# Altium schematic sheet MAX96724_PINOUT.SchDoc
size D; SheetNumber: 10; SheetTotal: 20
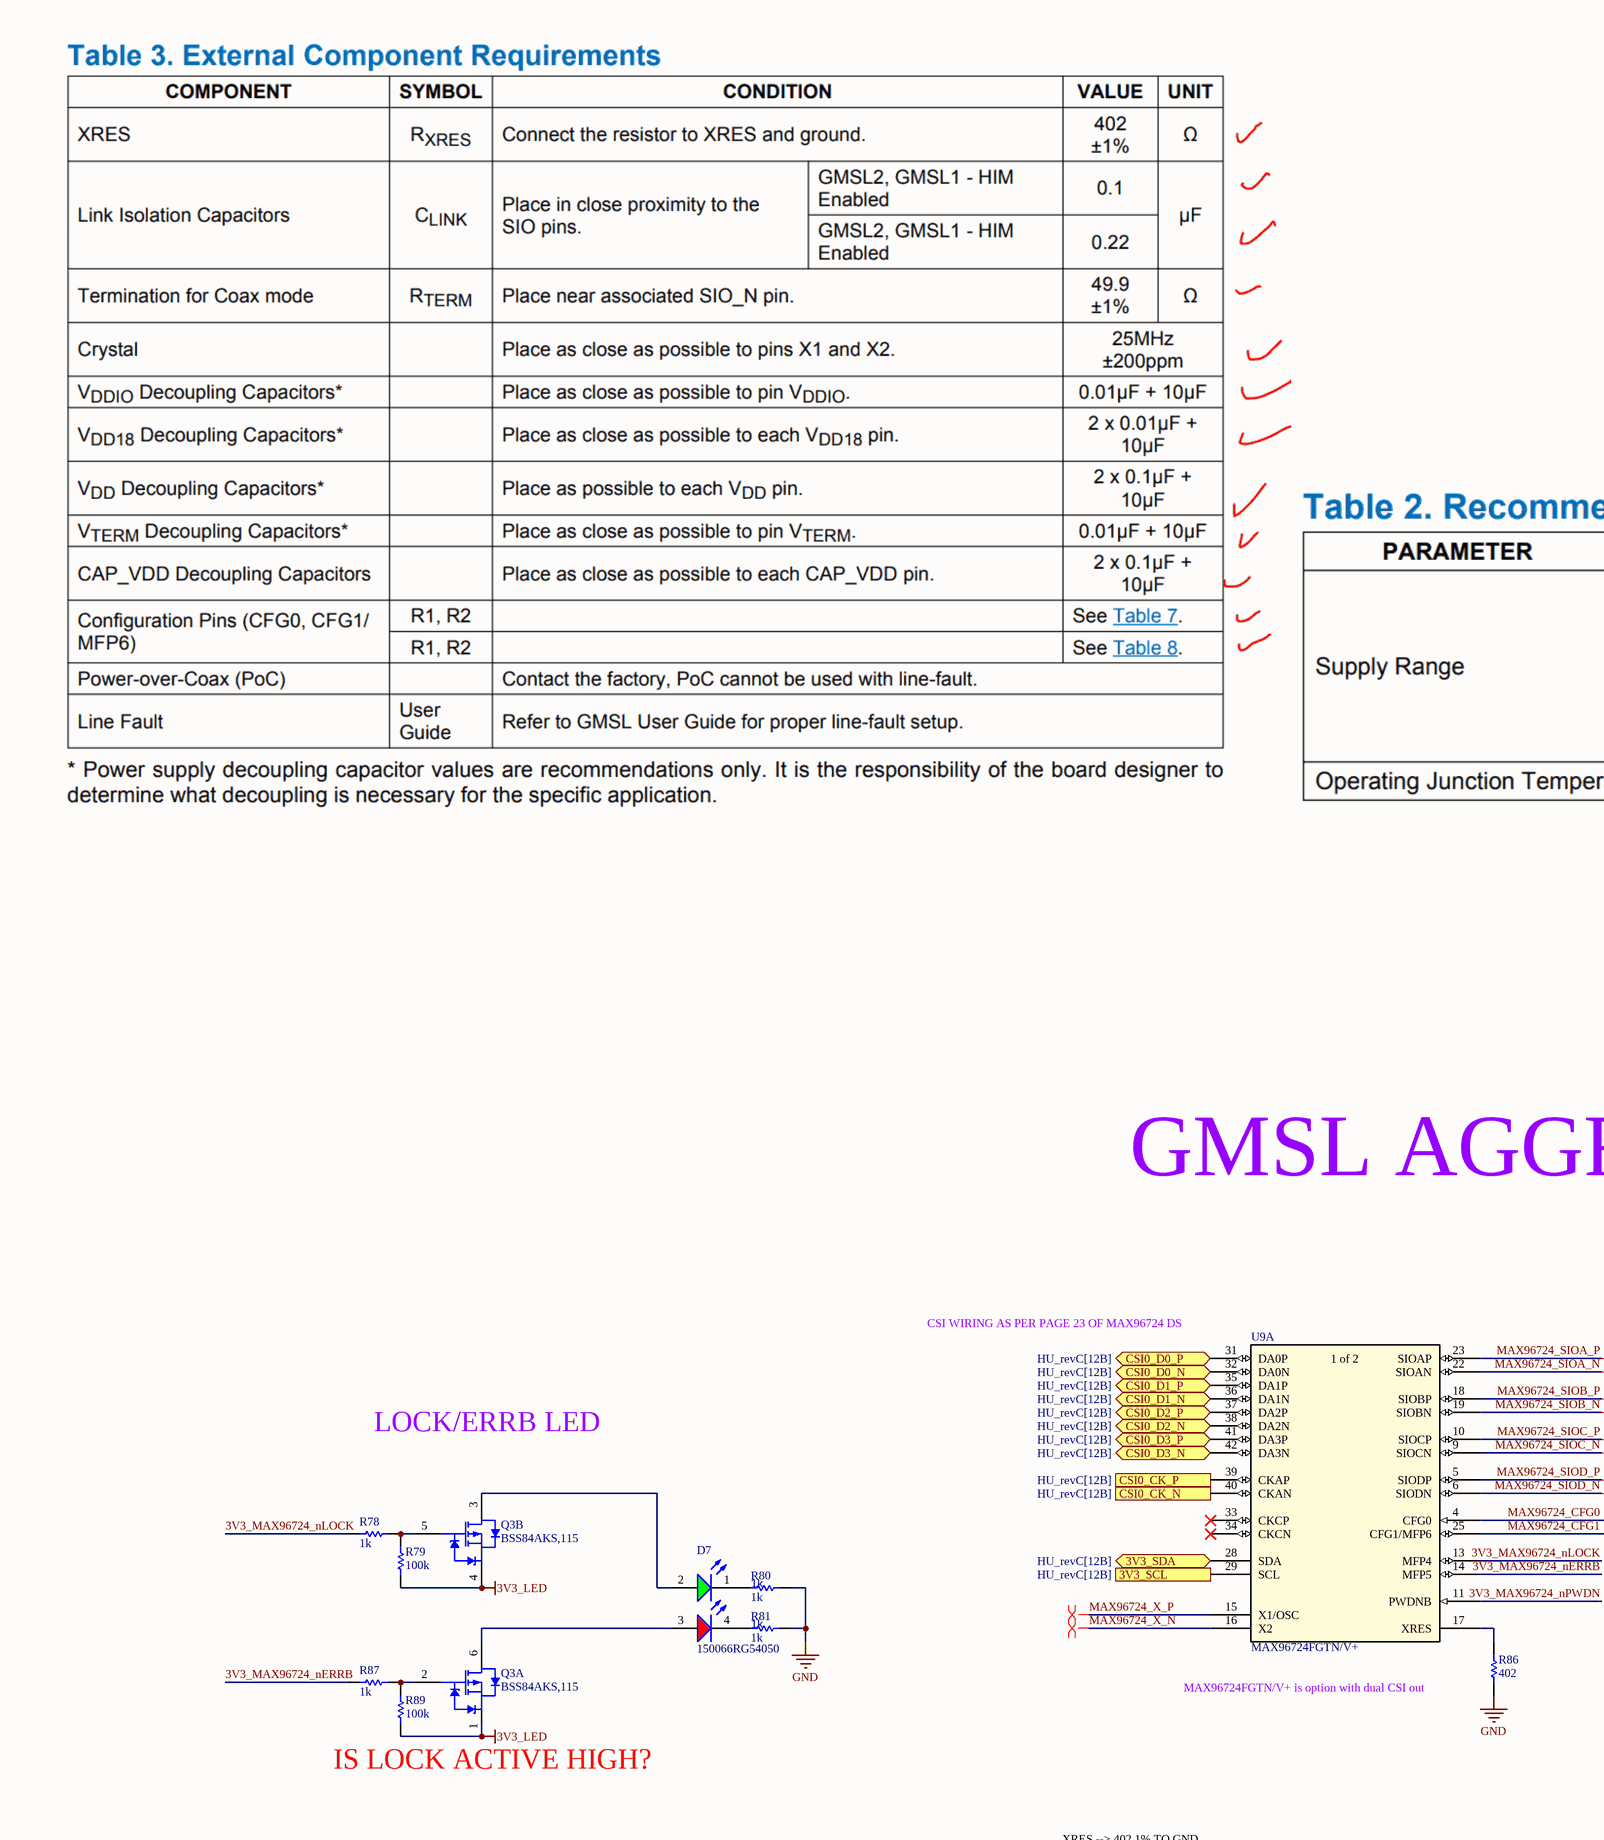
[diagram p0: MAX96724_PINOUT.SchDoc, top left]
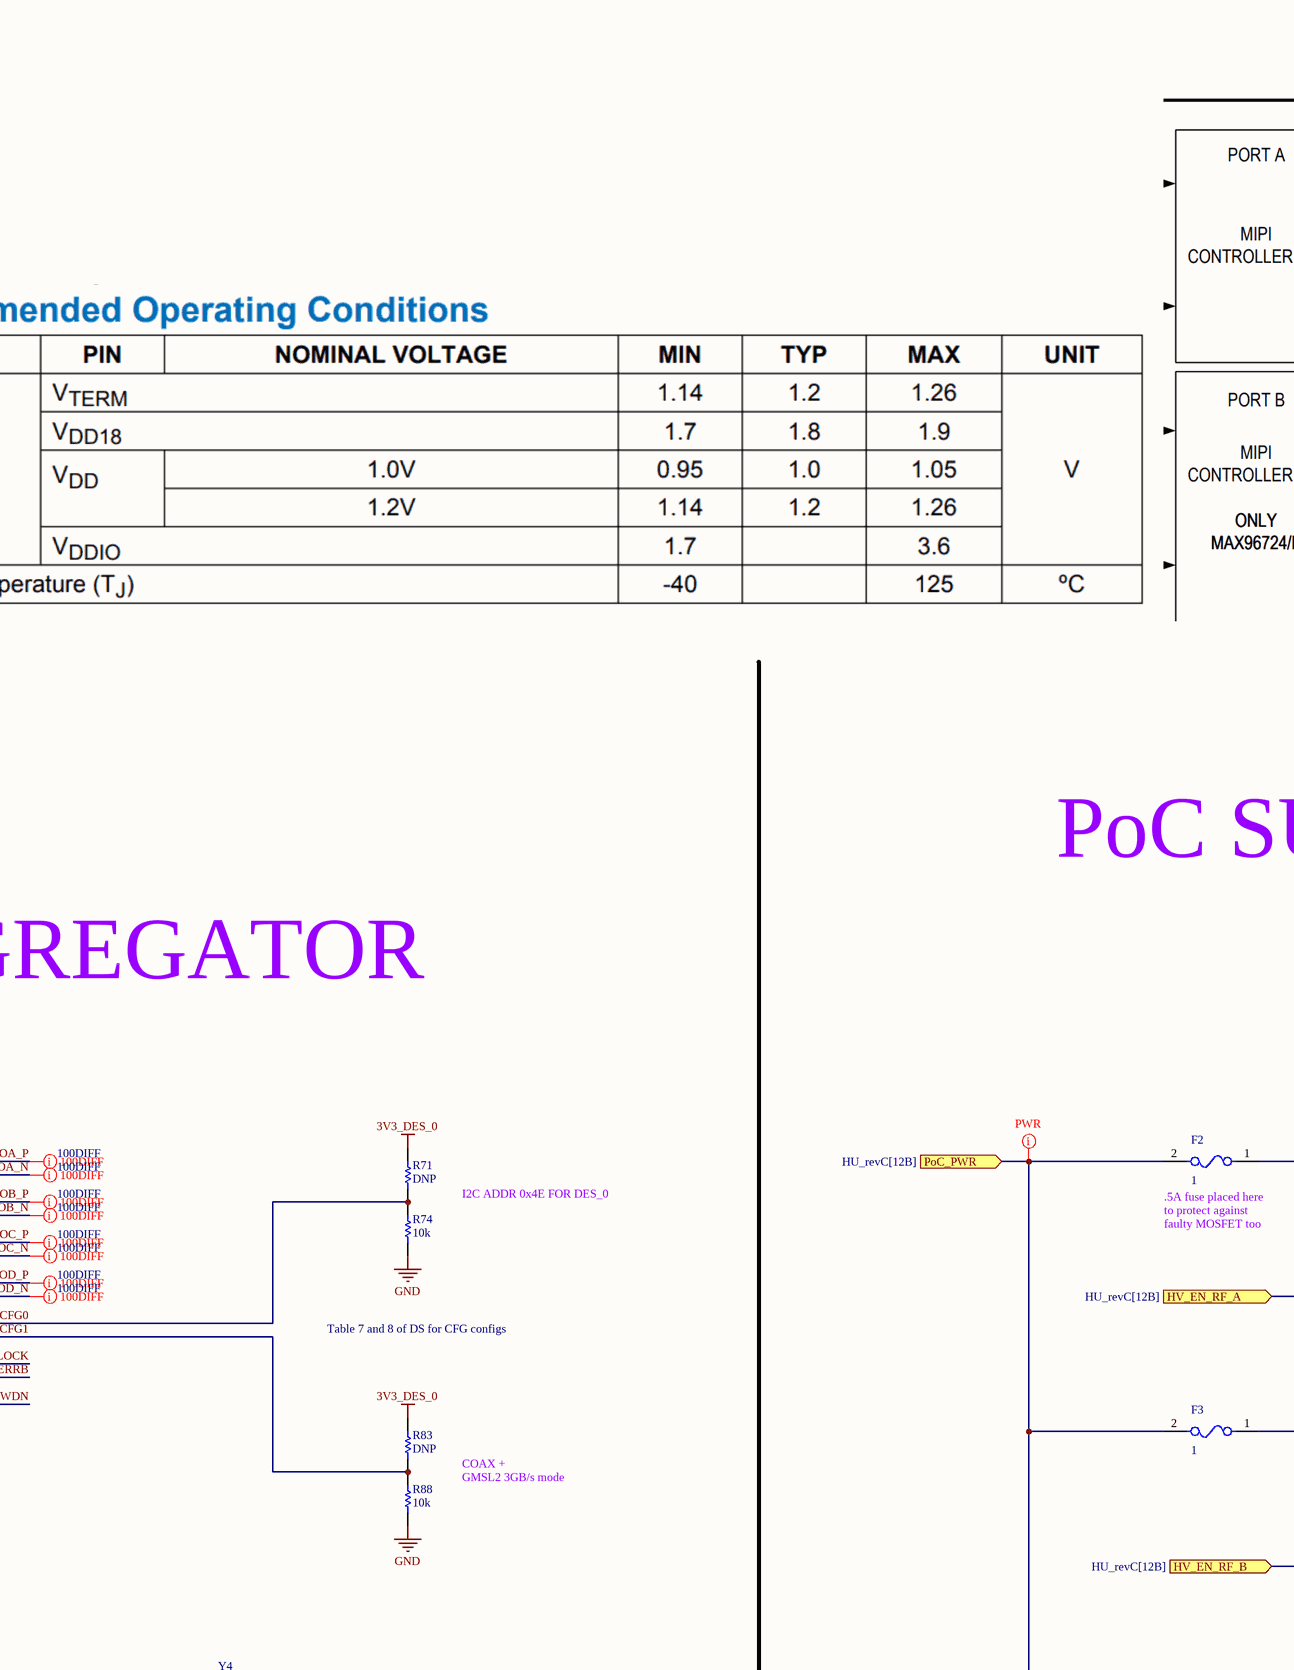
[diagram p1: MAX96724_PINOUT.SchDoc, top middle]
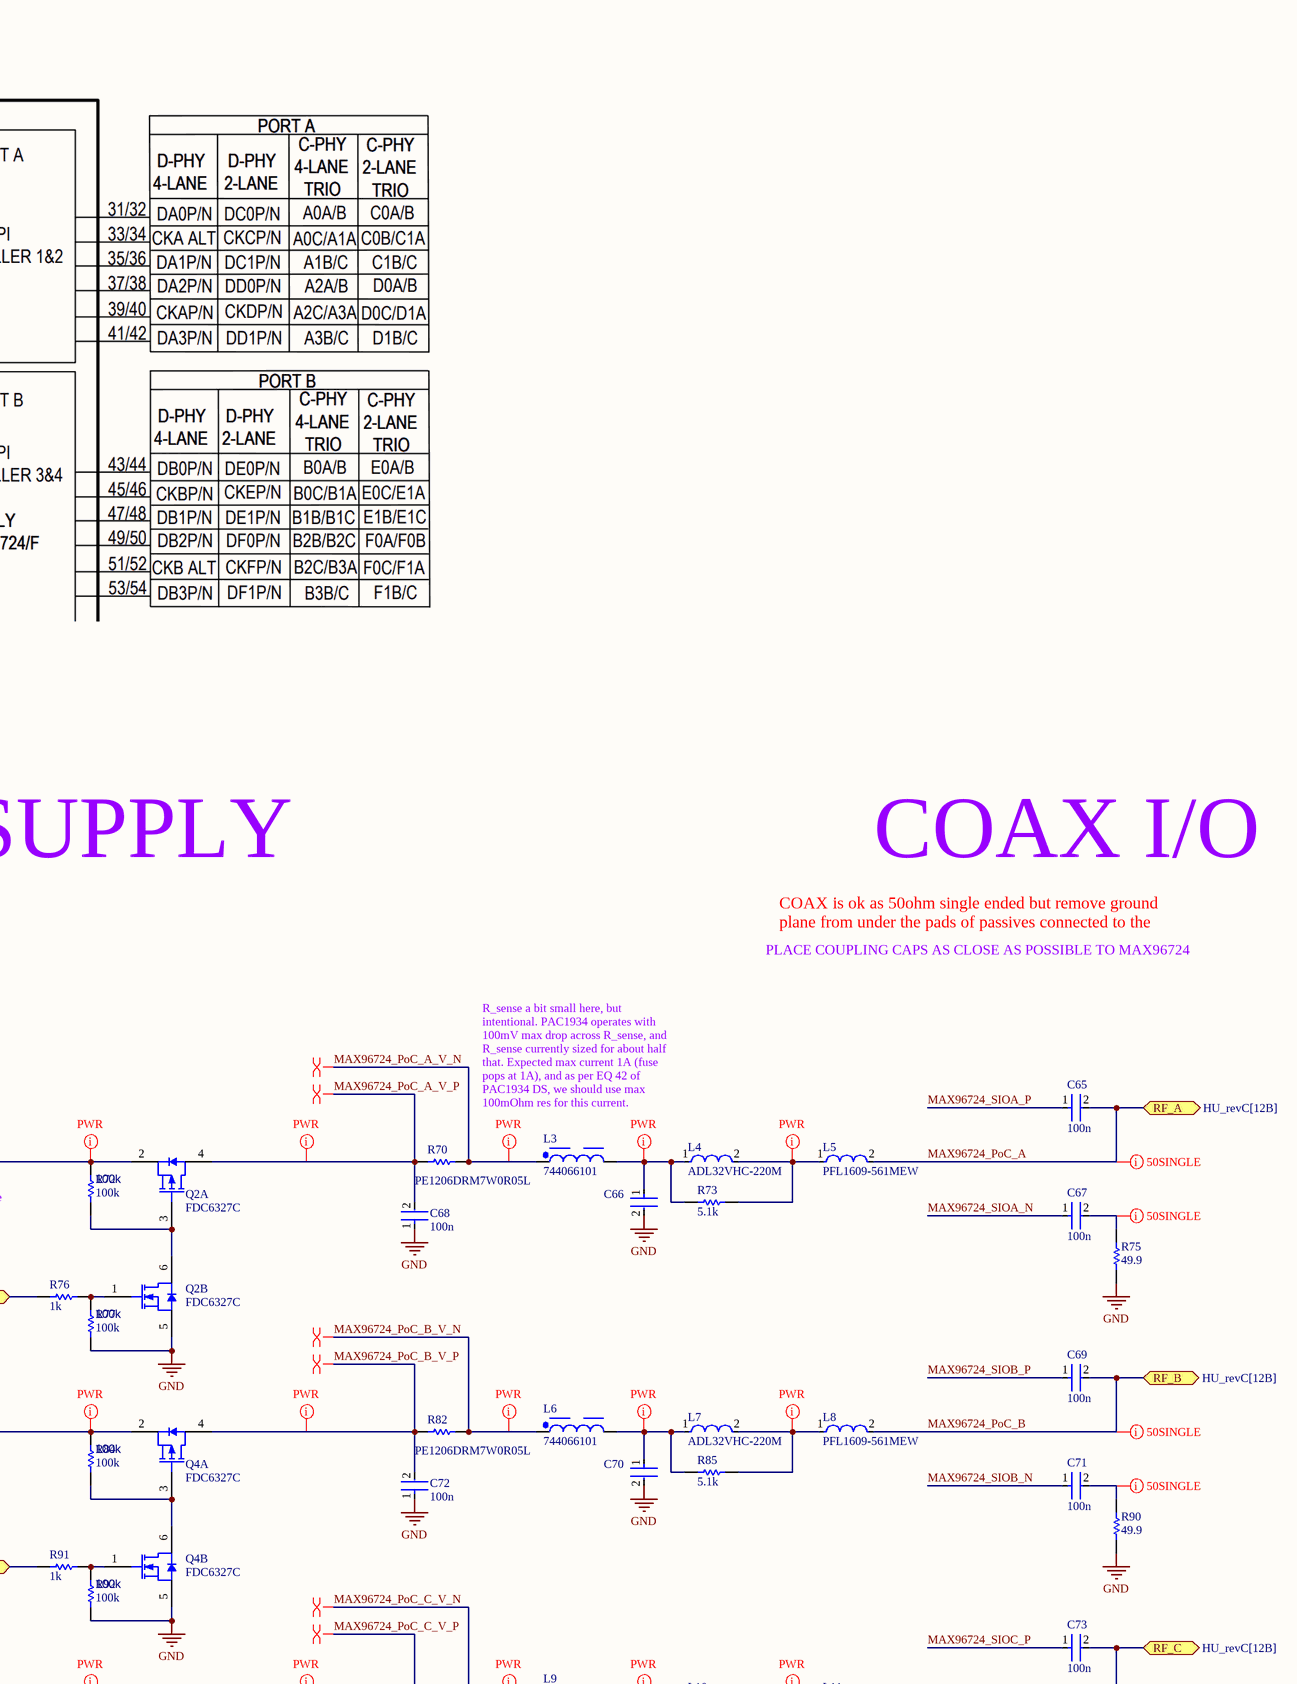
[diagram p2: MAX96724_PINOUT.SchDoc, top right]
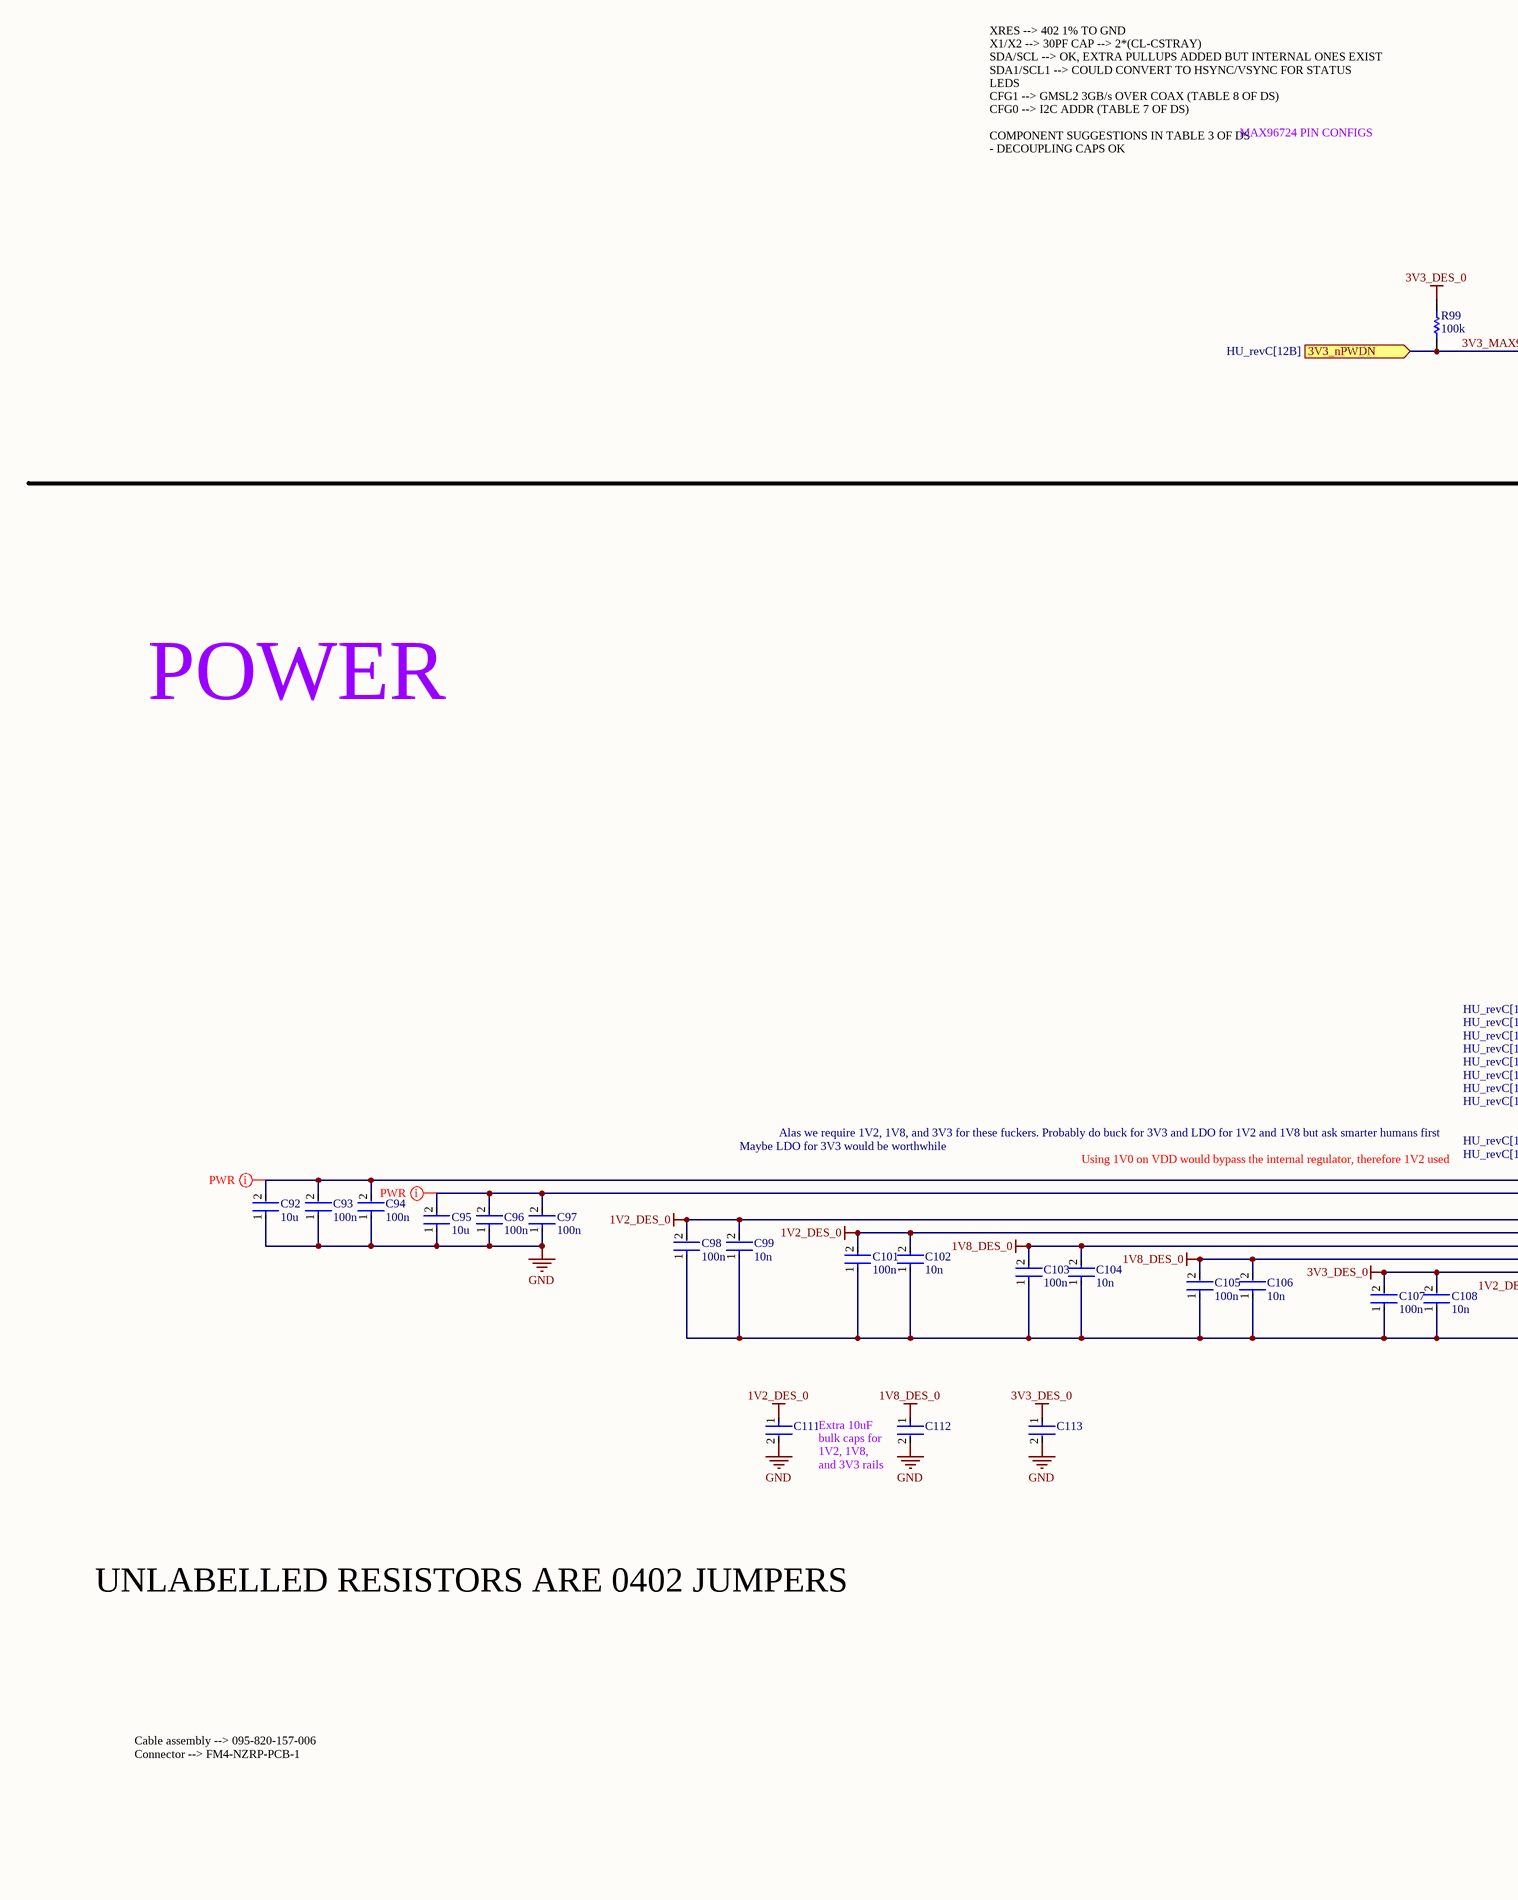
[diagram p3: MAX96724_PINOUT.SchDoc, bottom left]
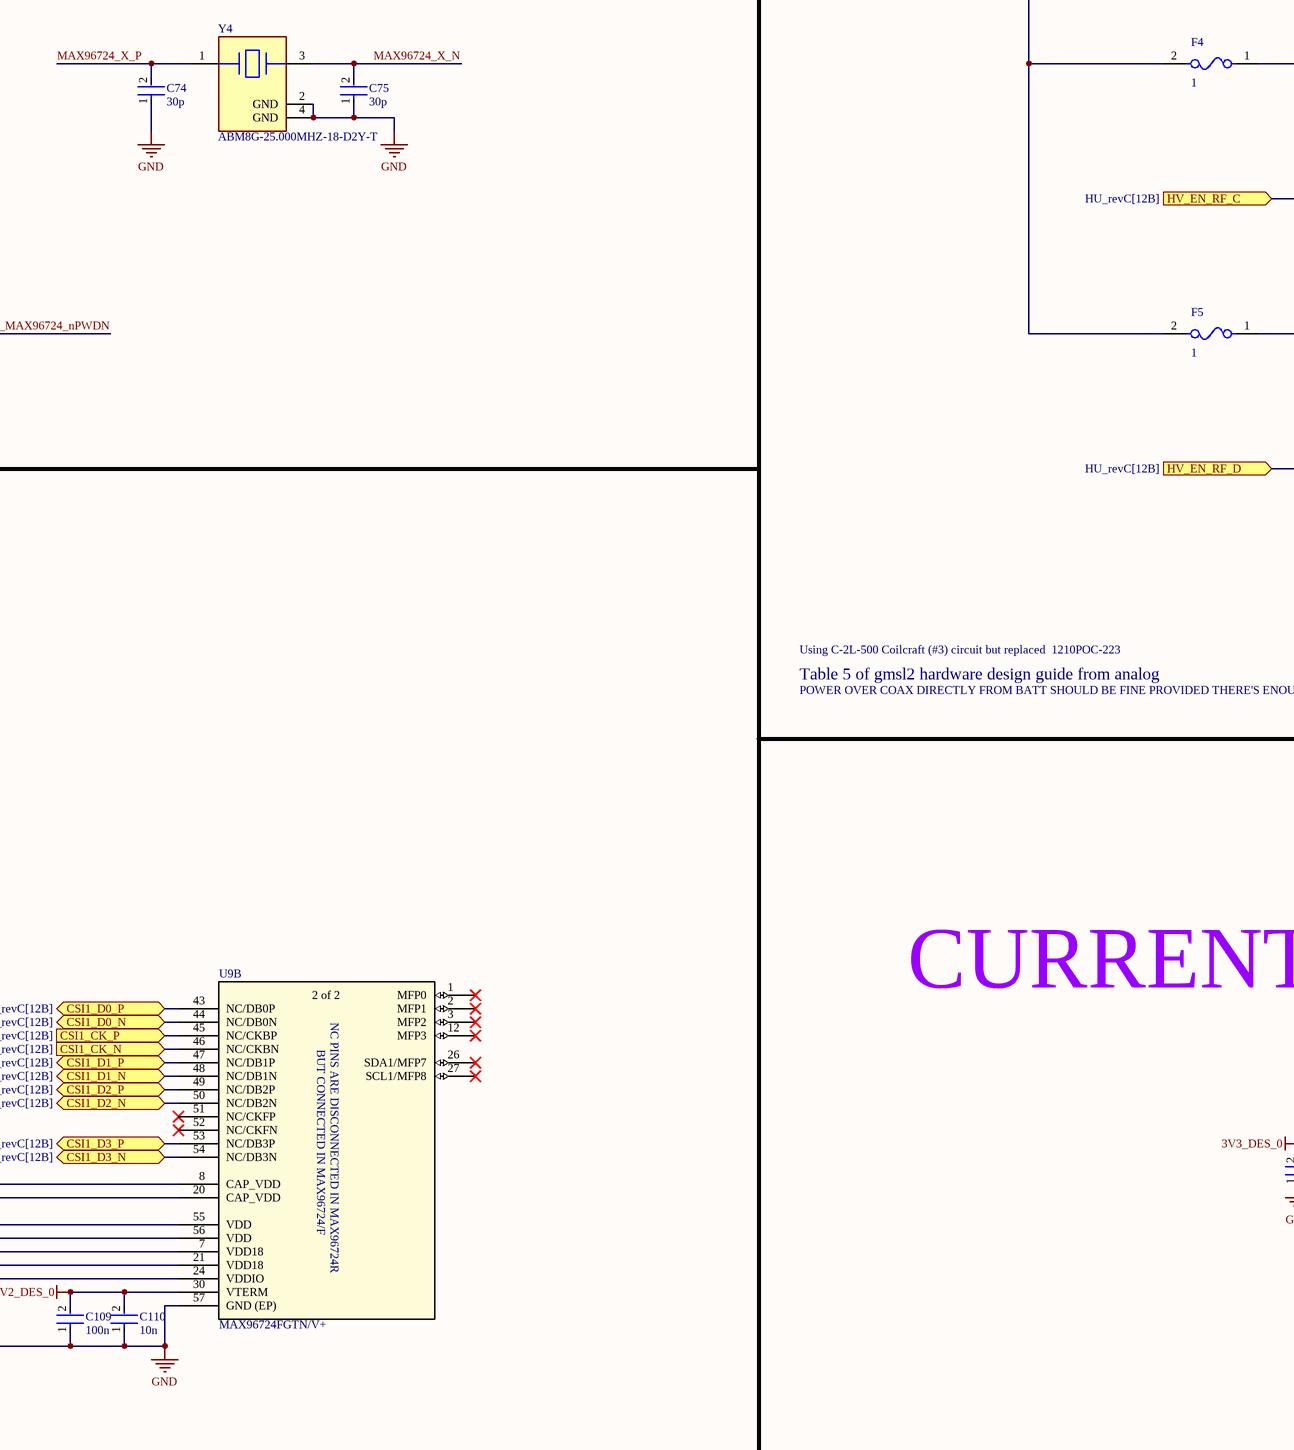
[diagram p4: MAX96724_PINOUT.SchDoc, bottom middle]
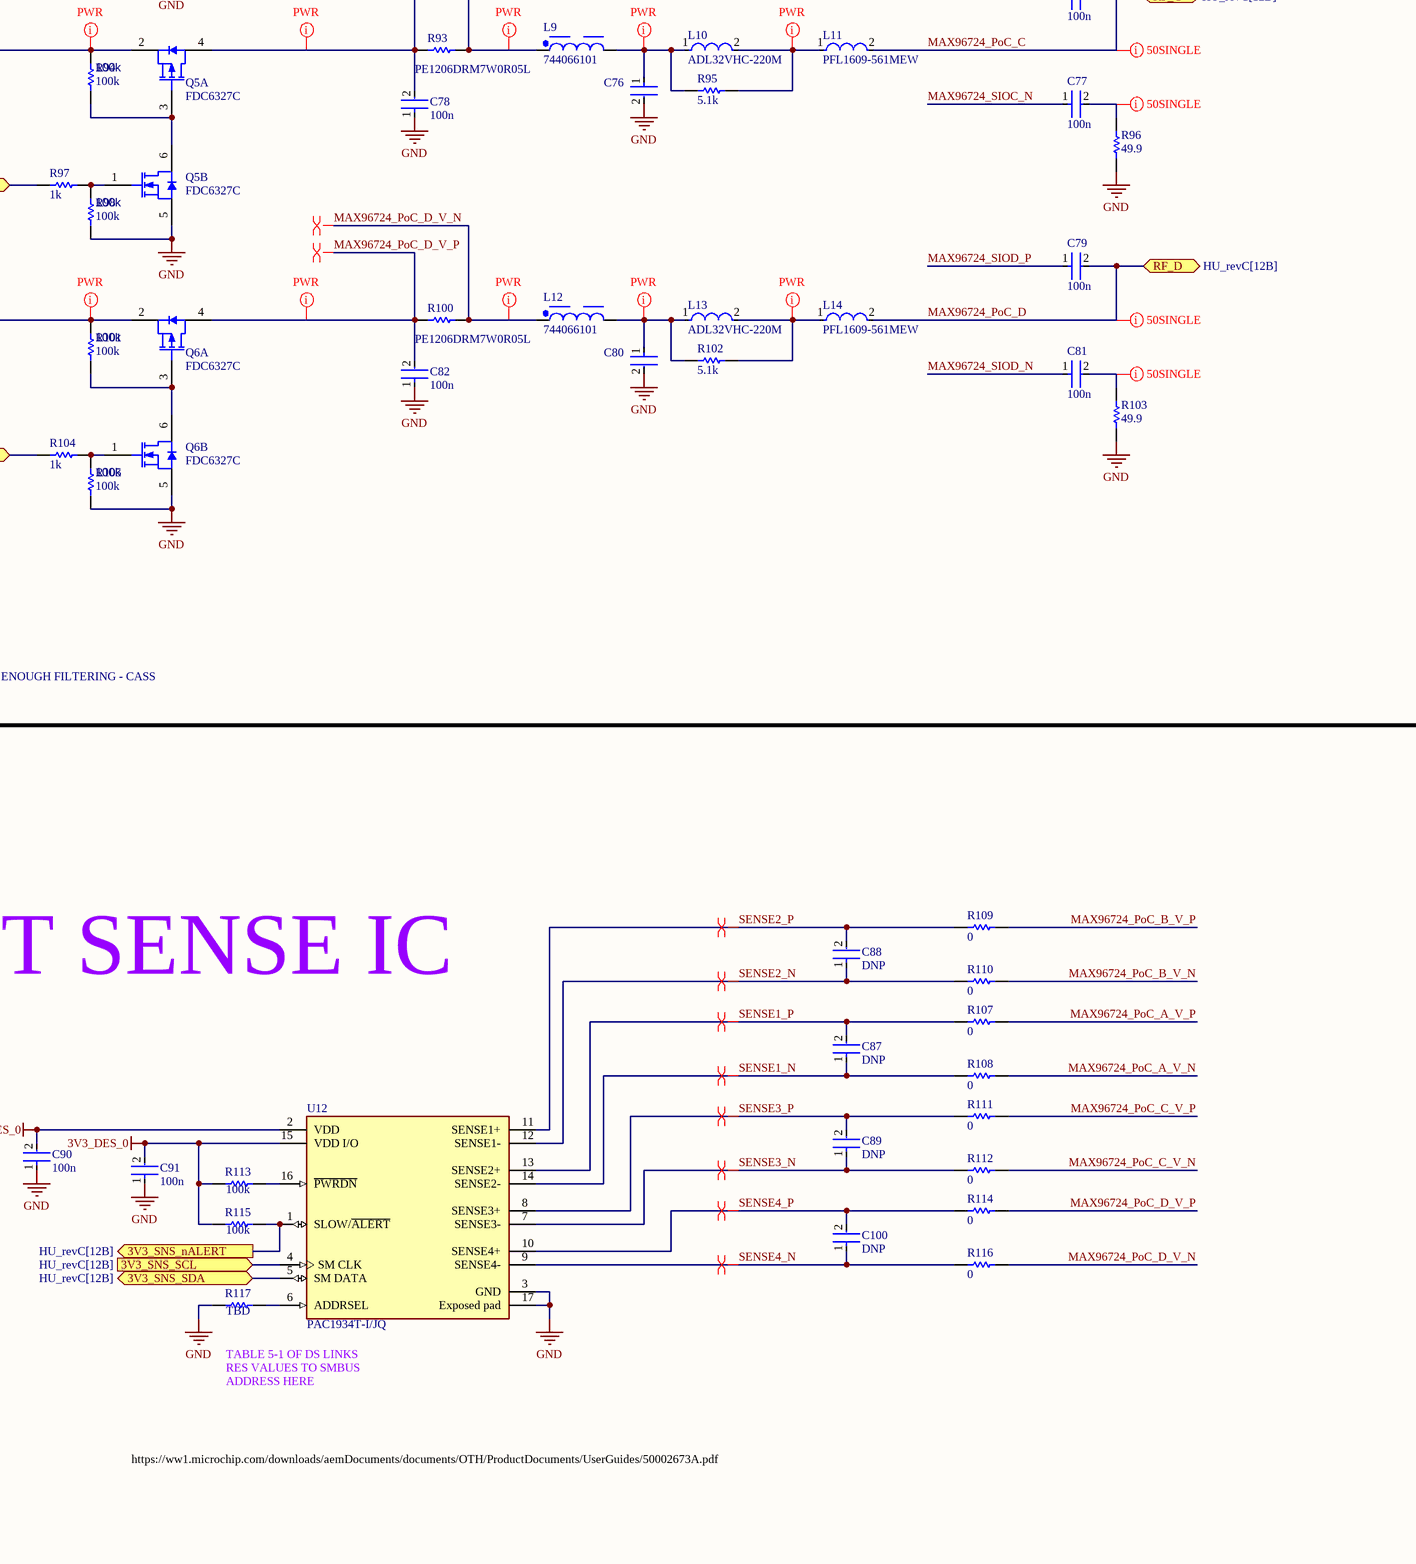
[diagram p5: MAX96724_PINOUT.SchDoc, bottom right]

## Parts
C65  100n  [FP-0402-L_1_0_0_05-W_0_5-IPC_A]
C66  GRM21BR61E226ME44L  [FP-GRM21B-0_2-e0_2_0_7-IPC_B]  (value not drawn)
C67  100n  [FP-0402-L_1_0_0_05-W_0_5-IPC_A]
C68  100n  [FP-0402-L_1_0_0_05-W_0_5-IPC_A]
C69  100n  [FP-0402-L_1_0_0_05-W_0_5-IPC_A]
C70  GRM21BR61E226ME44L  [FP-GRM21B-0_2-e0_2_0_7-IPC_B]  (value not drawn)
C71  100n  [FP-0402-L_1_0_0_05-W_0_5-IPC_A]
C72  100n  [FP-0402-L_1_0_0_05-W_0_5-IPC_A]
C73  100n  [FP-0402-L_1_0_0_05-W_0_5-IPC_A]
C74  30p  [FP-0402-L_1_0_0_05-W_0_5-IPC_A]
C75  30p  [FP-0402-L_1_0_0_05-W_0_5-IPC_A]
C76  GRM21BR61E226ME44L  [FP-GRM21B-0_2-e0_2_0_7-IPC_B]  (value not drawn)
C77  100n  [FP-0402-L_1_0_0_05-W_0_5-IPC_A]
C78  100n  [FP-0402-L_1_0_0_05-W_0_5-IPC_A]
C79  100n  [FP-0402-L_1_0_0_05-W_0_5-IPC_A]
C80  GRM21BR61E226ME44L  [FP-GRM21B-0_2-e0_2_0_7-IPC_B]  (value not drawn)
C81  100n  [FP-0402-L_1_0_0_05-W_0_5-IPC_A]
C82  100n  [FP-0402-L_1_0_0_05-W_0_5-IPC_A]
C87  DNP  [FP-0402-L_1_0_0_05-W_0_5-IPC_A]
C88  DNP  [FP-0402-L_1_0_0_05-W_0_5-IPC_A]
C89  DNP  [FP-0402-L_1_0_0_05-W_0_5-IPC_A]
C90  100n  [FP-0402-L_1_0_0_05-W_0_5-IPC_A]
C91  100n  [FP-0402-L_1_0_0_05-W_0_5-IPC_A]
C92  10u  [FP-0402-L_1_0_0_05-W_0_5-IPC_A]
C93  100n  [FP-0402-L_1_0_0_05-W_0_5-IPC_A]
C94  100n  [FP-0402-L_1_0_0_05-W_0_5-IPC_A]
C95  10u  [FP-0402-L_1_0_0_05-W_0_5-IPC_A]
C96  100n  [FP-0402-L_1_0_0_05-W_0_5-IPC_A]
C97  100n  [FP-0402-L_1_0_0_05-W_0_5-IPC_A]
C98  100n  [FP-0402-L_1_0_0_05-W_0_5-IPC_A]
C99  10n  [FP-0402-L_1_0_0_05-W_0_5-IPC_A]
C100  DNP  [FP-0402-L_1_0_0_05-W_0_5-IPC_A]
C101  100n  [FP-0402-L_1_0_0_05-W_0_5-IPC_A]
C102  10n  [FP-0402-L_1_0_0_05-W_0_5-IPC_A]
C103  100n  [FP-0402-L_1_0_0_05-W_0_5-IPC_A]
C104  10n  [FP-0402-L_1_0_0_05-W_0_5-IPC_A]
C105  100n  [FP-0402-L_1_0_0_05-W_0_5-IPC_A]
C106  10n  [FP-0402-L_1_0_0_05-W_0_5-IPC_A]
C107  100n  [FP-0402-L_1_0_0_05-W_0_5-IPC_A]
C108  10n  [FP-0402-L_1_0_0_05-W_0_5-IPC_A]
C109  100n  [FP-0402-L_1_0_0_05-W_0_5-IPC_A]
C110  10n  [FP-0402-L_1_0_0_05-W_0_5-IPC_A]
C111  EMK107BBJ106MA-T  [FP-0603-L_1_6_0_2-W_0_8_0-MFG]  (value not drawn)
C112  EMK107BBJ106MA-T  [FP-0603-L_1_6_0_2-W_0_8_0-MFG]  (value not drawn)
C113  EMK107BBJ106MA-T  [FP-0603-L_1_6_0_2-W_0_8_0-MFG]  (value not drawn)
D7  150066RG54050  [WL-SBCD_0606]
F2  1  [FP-0685T-MFG]
F3  1  [FP-0685T-MFG]
F4  1  [FP-0685T-MFG]
F5  1  [FP-0685T-MFG]
L3  744066101  [WE-TPC_1038]
L4  ADL32VHC-220M  [FP-1210POC-MFG]
L5  PFL1609-561MEW  [FP-PFL1609-MFG]
L6  744066101  [WE-TPC_1038]
L7  ADL32VHC-220M  [FP-1210POC-MFG]
L8  PFL1609-561MEW  [FP-PFL1609-MFG]
L9  744066101  [WE-TPC_1038]
L10  ADL32VHC-220M  [FP-1210POC-MFG]
L11  PFL1609-561MEW  [FP-PFL1609-MFG]
L12  744066101  [WE-TPC_1038]
L13  ADL32VHC-220M  [FP-1210POC-MFG]
L14  PFL1609-561MEW  [FP-PFL1609-MFG]
Q2  FDC6327C  [FAIR-SOT23-6_V]  (parts A,B of 2)
Q3  BSS84AKS,115  [NXP-SOT363_L]  (parts A,B of 2)
Q4  FDC6327C  [FAIR-SOT23-6_V]  (parts A,B of 2)
Q5  FDC6327C  [FAIR-SOT23-6_V]  (parts A,B of 2)
Q6  FDC6327C  [FAIR-SOT23-6_V]  (parts A,B of 2)
R70  PE1206DRM7W0R05L  [R1206B]
R71  DNP  [R0603B]
R72  100k  [R0603B]
R73  5.1k  [R0603B]
R74  10k  [R0603B]
R75  49.9  [R0603B]
R76  1k  [R0603B]
R77  100k  [R0603B]
R78  1k  [R0603B]
R79  100k  [R0603B]
R80  1k  [R0603B]
R81  1k  [R0603B]
R82  PE1206DRM7W0R05L  [R1206B]
R83  DNP  [R0603B]
R84  100k  [R0603B]
R85  5.1k  [R0603B]
R86  402  [R0603B]
R87  1k  [R0603B]
R88  10k  [R0603B]
R89  100k  [R0603B]
R90  49.9  [R0603B]
R91  1k  [R0603B]
R92  100k  [R0603B]
R93  PE1206DRM7W0R05L  [R1206B]
R94  100k  [R0603B]
R95  5.1k  [R0603B]
R96  49.9  [R0603B]
R97  1k  [R0603B]
R98  100k  [R0603B]
R99  100k  [R0603B]
R100  PE1206DRM7W0R05L  [R1206B]
R101  100k  [R0603B]
R102  5.1k  [R0603B]
R103  49.9  [R0603B]
R104  1k  [R0603B]
R105  100k  [R0603B]
R107  0  [R0603B]
R108  0  [R0603B]
R109  0  [R0603B]
R110  0  [R0603B]
R111  0  [R0603B]
R112  0  [R0603B]
R113  100k  [R0603B]
R114  0  [R0603B]
R115  100k  [R0603B]
R116  0  [R0603B]
R117  TBD  [R0603B]
U9  MAX96724FGTN/V+  [MAX96724FGTN_V+-Footprint-1]  (parts A,B of 2)
U12  PAC1934T-I/JQ  [FP-C04-257-MFG]
Y4  ABM8G-25.000MHZ-18-D2Y-T  [FP-ABM8G-MFG]

## Ports
3V3_nPWDN (in, see HU_revC[12B]), 3V3_SCL (in, see HU_revC[12B]), 3V3_SDA (bidir, see HU_revC[12B]), 3V3_SNS_nALERT (out, see HU_revC[12B]), 3V3_SNS_SCL (in, see HU_revC[12B]), 3V3_SNS_SDA (bidir, see HU_revC[12B]), CSI0_CK_N (in, see HU_revC[12B]), CSI0_CK_P (in, see HU_revC[12B]), CSI0_D0_N (bidir, see HU_revC[12B]), CSI0_D0_P (bidir, see HU_revC[12B]), CSI0_D1_N (bidir, see HU_revC[12B]), CSI0_D1_P (bidir, see HU_revC[12B]), CSI0_D2_N (bidir, see HU_revC[12B]), CSI0_D2_P (bidir, see HU_revC[12B]), CSI0_D3_N (bidir, see HU_revC[12B]), CSI0_D3_P (bidir, see HU_revC[12B]), CSI1_CK_N (in, see HU_revC[12B]), CSI1_CK_P (in, see HU_revC[12B]), CSI1_D0_N (bidir, see HU_revC[12B]), CSI1_D0_P (bidir, see HU_revC[12B]), CSI1_D1_N (bidir, see HU_revC[12B]), CSI1_D1_P (bidir, see HU_revC[12B]), CSI1_D2_N (bidir, see HU_revC[12B]), CSI1_D2_P (bidir, see HU_revC[12B]), CSI1_D3_N (bidir, see HU_revC[12B]), CSI1_D3_P (bidir, see HU_revC[12B]), HV_EN_RF_A (in, see HU_revC[12B]), HV_EN_RF_B (in, see HU_revC[12B]), HV_EN_RF_C (in, see HU_revC[12B]), HV_EN_RF_D (in, see HU_revC[12B]), PoC_PWR (in, see HU_revC[12B]), RF_A (bidir, see HU_revC[12B]), RF_B (bidir, see HU_revC[12B]), RF_C (bidir, see HU_revC[12B]), RF_D (bidir, see HU_revC[12B])

## Nets
1V2_DES_0: C98.2 C99.2 C101.2 C102.2 C109.2 C110.2 C111.1 U9.30(VTERM) U9.55(VDD) U9.56(VDD)
1V8_DES_0: C103.2 C104.2 C105.2 C106.2 C112.1 U9.7(VDD18) U9.21(VDD18)
3V3_DES_0: C90.2 C91.2 C107.2 C108.2 C113.1 R71.2 R83.2 R99.2 R113.2 R115.2 U9.24(VDDIO) U12.2(VDD) U12.15(VDD_I/O)
3V3_LED: Q3.1(S1) Q3.4(S2) R79.2 R89.1
GND: C66.2 C68.1 C70.2 C72.1 C74.1 C75.1 C76.2 C78.1 C80.2 C82.1 C90.1 C91.1 C92.1 C93.1 C94.1 C95.1 C96.1 C97.1 C98.1 C99.1 C101.1 C102.1 C103.1 C104.1 C105.1 C106.1 C107.1 C108.1 C109.1 C110.1 C111.2 C112.2 C113.2 Q2.5(S) Q4.5(S) Q5.5(S) Q6.5(S) R74.1 R75.1 R77.1 R80.1 R81.1 R86.1 R88.1 R90.1 R92.1 R96.1 R98.1 R103.1 R105.1 R117.2 U9.57(GND_(EP)) U12.3(GND) U12.17(Exposed_pad) Y4.2(GND) Y4.4(GND)
3V3_MAX96724_nERRB: R87.1 U9.14(MFP5)
3V3_MAX96724_nLOCK: R78.2 U9.13(MFP4)
3V3_MAX96724_nPWDN: R99.1 U9.11(PWDNB) ; port 3V3_nPWDN
3V3_SCL: U9.29(SCL) ; port 3V3_SCL
3V3_SDA: U9.28(SDA) ; port 3V3_SDA
3V3_SNS_nALERT: R115.1 U12.1(SLOW/~{ALERT}) ; port 3V3_SNS_nALERT
3V3_SNS_SCL: U12.4(SM_CLK) ; port 3V3_SNS_SCL
3V3_SNS_SDA: U12.5(SM_DATA) ; port 3V3_SNS_SDA
CSI0_CK_N: U9.40(CKAN) ; port CSI0_CK_N
CSI0_CK_P: U9.39(CKAP) ; port CSI0_CK_P
CSI0_D0_N: U9.32(DA0N) ; port CSI0_D0_N
CSI0_D0_P: U9.31(DA0P) ; port CSI0_D0_P
CSI0_D1_N: U9.36(DA1N) ; port CSI0_D1_N
CSI0_D1_P: U9.35(DA1P) ; port CSI0_D1_P
CSI0_D2_N: U9.38(DA2N) ; port CSI0_D2_N
CSI0_D2_P: U9.37(DA2P) ; port CSI0_D2_P
CSI0_D3_N: U9.42(DA3N) ; port CSI0_D3_N
CSI0_D3_P: U9.41(DA3P) ; port CSI0_D3_P
CSI1_CK_N: U9.46(NC/CKBN) ; port CSI1_CK_N
CSI1_CK_P: U9.45(NC/CKBP) ; port CSI1_CK_P
CSI1_D0_N: U9.44(NC/DB0N) ; port CSI1_D0_N
CSI1_D0_P: U9.43(NC/DB0P) ; port CSI1_D0_P
CSI1_D1_N: U9.48(NC/DB1N) ; port CSI1_D1_N
CSI1_D1_P: U9.47(NC/DB1P) ; port CSI1_D1_P
CSI1_D2_N: U9.50(NC/DB2N) ; port CSI1_D2_N
CSI1_D2_P: U9.49(NC/DB2P) ; port CSI1_D2_P
CSI1_D3_N: U9.54(NC/DB3N) ; port CSI1_D3_N
CSI1_D3_P: U9.53(NC/DB3P) ; port CSI1_D3_P
HV_EN_RF_A: R76.2 ; port HV_EN_RF_A
HV_EN_RF_B: R91.2 ; port HV_EN_RF_B
HV_EN_RF_C: R97.2 ; port HV_EN_RF_C
HV_EN_RF_D: R104.2 ; port HV_EN_RF_D
MAX96724_CFG0: R71.1 R74.2 U9.4(CFG0)
MAX96724_CFG1: R83.1 R88.2 U9.25(CFG1/MFP6)
MAX96724_PoC_A: C65.2 L5.2 ; port RF_A
MAX96724_PoC_A_V_N: L3.1 R70.1 R108.1
MAX96724_PoC_A_V_P: C68.2 Q2.4(D) R70.2 R107.1
MAX96724_PoC_B: C69.2 L8.2 ; port RF_B
MAX96724_PoC_B_V_N: L6.1 R82.1 R110.1
MAX96724_PoC_B_V_P: C72.2 Q4.4(D) R82.2 R109.1
MAX96724_PoC_C: C73.2 L11.2 ; port RF_C
MAX96724_PoC_C_V_N: L9.1 R93.1 R112.1
MAX96724_PoC_C_V_P: C78.2 Q5.4(D) R93.2 R111.1
MAX96724_PoC_D: C79.2 L14.2 ; port RF_D
MAX96724_PoC_D_V_N: L12.1 R100.1 R116.1
MAX96724_PoC_D_V_P: C82.2 Q6.4(D) R100.2 R114.1
MAX96724_SIOA_N: C67.1 U9.22(SIOAN)
MAX96724_SIOA_P: C65.1 U9.23(SIOAP)
MAX96724_SIOB_N: C71.1 U9.19(SIOBN)
MAX96724_SIOB_P: C69.1 U9.18(SIOBP)
MAX96724_SIOC_N: C77.1 U9.9(SIOCN)
MAX96724_SIOC_P: C73.1 U9.10(SIOCP)
MAX96724_SIOD_N: C81.1 U9.6(SIODN)
MAX96724_SIOD_P: C79.1 U9.5(SIODP)
MAX96724_X_N: C75.2 U9.16(X2) Y4.3
MAX96724_X_P: C74.2 U9.15(X1/OSC) Y4.1
PoC_PWR: F2.2 F3.2 F4.2 F5.2 ; port PoC_PWR
SENSE1_N: C87.1 R108.2 U12.14(SENSE2-)
SENSE1_P: C87.2 R107.2 U12.13(SENSE2+)
SENSE2_N: C88.1 R110.2 U12.12(SENSE1-)
SENSE2_P: C88.2 R109.2 U12.11(SENSE1+)
SENSE3_N: C89.1 R112.2 U12.7(SENSE3-)
SENSE3_P: C89.2 R111.2 U12.8(SENSE3+)
SENSE4_N: C100.1 R116.2 U12.9(SENSE4-)
SENSE4_P: C100.2 R114.2 U12.10(SENSE4+)
NetC66_1: C66.1 L3.2 L4.1 R73.2
NetC67_2: C67.2 R75.2
NetC70_1: C70.1 L6.2 L7.1 R85.2
NetC71_2: C71.2 R90.2
NetC76_1: C76.1 L9.2 L10.1 R95.2
NetC77_2: C77.2 R96.2
NetC80_1: C80.1 L12.2 L13.1 R102.2
NetC81_2: C81.2 R103.2
NetC92_2: C92.2 C93.2 C94.2 U9.8(CAP_VDD)
NetC95_2: C95.2 C96.2 C97.2 U9.20(CAP_VDD)
NetD7_1: D7.1(K) R80.2
NetD7_2: D7.2(A) Q3.3(D2)
NetD7_3: D7.3(A) Q3.6(D1)
NetD7_4: D7.4(K) R81.2
NetF2_1: F2.1 Q2.2(S) R72.2
NetF3_1: F3.1 Q4.2(S) R84.2
NetF4_1: F4.1 Q5.2(S) R94.2
NetF5_1: F5.1 Q6.2(S) R101.2
NetL4_2: L4.2 L5.1 R73.1
NetL7_2: L7.2 L8.1 R85.1
NetL10_2: L10.2 L11.1 R95.1
NetL13_2: L13.2 L14.1 R102.1
NetQ2_1: Q2.1(G) R76.1 R77.2
NetQ2_3: Q2.3(G) Q2.6(D) R72.1
NetQ3_2: Q3.2(G1) R87.2 R89.2
NetQ3_5: Q3.5(G2) R78.1 R79.1
NetQ4_1: Q4.1(G) R91.1 R92.2
NetQ4_3: Q4.3(G) Q4.6(D) R84.1
NetQ5_1: Q5.1(G) R97.1 R98.2
NetQ5_3: Q5.3(G) Q5.6(D) R94.1
NetQ6_1: Q6.1(G) R104.1 R105.2
NetQ6_3: Q6.3(G) Q6.6(D) R101.1
NetR86_2: R86.2 U9.17(XRES)
NetR113_1: R113.1 U12.16(~{PWRDN})
NetR117_1: R117.1 U12.6(ADDRSEL)

Not connected (* = marked no-connect by the designer): U9 1(MFP0)* 2(MFP1)* 3(MFP2)* 12(MFP3)* 26(SDA1/MFP7)* 27(SCL1/MFP8)* 33(CKCP)* 34(CKCN)* 51(NC/CKFP)* 52(NC/CKFN)*

## Layout directives
net class 50SINGLE: MAX96724_PoC_A, MAX96724_PoC_B, MAX96724_PoC_C, MAX96724_PoC_D, NetC67_2, NetC71_2, NetC77_2, NetC81_2
differential pair: MAX96724_PoC_A_V_N, MAX96724_PoC_A_V_P, MAX96724_PoC_B_V_N, MAX96724_PoC_B_V_P, MAX96724_PoC_C_V_N, MAX96724_PoC_C_V_P, MAX96724_PoC_D_V_N, MAX96724_PoC_D_V_P, MAX96724_X_N, MAX96724_X_P, SENSE1_N, SENSE1_P, SENSE2_N, SENSE2_P, SENSE3_N, SENSE3_P, SENSE4_N, SENSE4_P
net class PWR: MAX96724_PoC_A_V_N, MAX96724_PoC_A_V_P, MAX96724_PoC_B_V_N, MAX96724_PoC_B_V_P, MAX96724_PoC_C_V_N, MAX96724_PoC_C_V_P, MAX96724_PoC_D_V_N, MAX96724_PoC_D_V_P, NetC66_1, NetC70_1, NetC76_1, NetC80_1, NetC92_2, NetC95_2, NetF2_1, NetF3_1, NetF4_1, NetF5_1, NetL4_2, NetL7_2, NetL10_2, NetL13_2, PoC_PWR
differential pair; differential pair class 100DIFF: MAX96724_SIOA_N, MAX96724_SIOA_P, MAX96724_SIOB_N, MAX96724_SIOB_P, MAX96724_SIOC_N, MAX96724_SIOC_P, MAX96724_SIOD_N, MAX96724_SIOD_P

## Notes on the sheet
- PoC SUPPLY
- COAX I/O
- PLACE COUPLING CAPS AS CLOSE AS POSSIBLE TO MAX96724
- COAX is ok as 50ohm single ended but remove ground plane from under the pads of passives connected to the GMSL trace
- GMSL AGGREGATOR
- R_sense a bit small here, but intentional. PAC1934 operates with 100mV max drop across R_sense, and R_sense currently sized for about half that. Expected max current 1A (fuse pops at 1A), and as per EQ 42 of PAC1934 DS, we should use max 100mOhm res for this current.
- CSI WIRING AS PER PAGE 23 OF MAX96724 DS
- LOCK/ERRB LED
- I2C ADDR 0x4E FOR DES_0
- (near F2) .5A fuse placed here to protect against faulty MOSFET too
- Table 7 and 8 of DS for CFG configs
- MAX96724FGTN/V+ is option with dual CSI out
- GMSL2 3GB/s mode
- COAX +
- IS LOCK ACTIVE HIGH?
- XRES --> 402 1% TO GND
  X1/X2 --> 30PF CAP --> 2*(CL-CSTRAY)
  SDA/SCL --> OK, EXTRA PULLUPS ADDED BUT INTERNAL ONES EXIST
  SDA1/SCL1 --> COULD CONVERT TO HSYNC/VSYNC FOR STATUS LEDS
  CFG1 --> GMSL2 3GB/s OVER COAX (TABLE 8 OF DS)
  CFG0 --> I2C ADDR (TABLE 7 OF DS)
  COMPONENT SUGGESTIONS IN TABLE 3 OF DS
  - DECOUPLING CAPS OK
- MAX96724 PIN CONFIGS
- Table 5 of gmsl2 hardware design guide from analog
- POWER OVER COAX DIRECTLY FROM BATT SHOULD BE FINE PROVIDED THERE'S ENOUGH FILTERING - CASS
- Using C-2L-500 Coilcraft (#3) circuit but replaced  1210POC-223
- POWER
- CURRENT SENSE IC
- Maybe LDO for 3V3 would be worthwhile
- Alas we require 1V2, 1V8, and 3V3 for these fuckers. Probably do buck for 3V3 and LDO for 1V2 and 1V8 but ask smarter humans first
- Using 1V0 on VDD would bypass the internal regulator, therefore 1V2 used
- TABLE 5-1 OF DS LINKS RES VALUES TO SMBUS ADDRESS HERE
- Extra 10uF bulk caps for 1V2, 1V8, and 3V3 rails
- https://ww1.microchip.com/downloads/aemDocuments/documents/OTH/ProductDocuments/UserGuides/50002673A.pdf
- UNLABELLED RESISTORS ARE 0402 JUMPERS
- Cable assembly --> 095-820-157-006
  Connector --> FM4-NZRP-PCB-1
- (in symbol CMP-015-00011-4, part A) 1 of 2
- (in symbol CMP-015-00011-4, part B) 2 of 2; NC PINS ARE DISCONNECTED IN MAX96724R; BUT CONNECTED IN MAX96724/F

## Library data of the parts
C65 C67-C69 C71-C75 C77-C79 C81 C82 C87-C110 = CMP-001-00058-1: LARGE PADS, 0402 CAP, CHANGE COMMENT TO MATCH REAL P/N; Capacitor Type: Ceramic; Min Operating Temperature: -55°C; Mounting Technology: Surface Mount; Pins: 2; Case/Package: 0402; RoHS Compliant: Yes; Max Operating Temperature: 85°C
C66 C70 C76 C80 = CMP-2007-03222-3: Chip Multilayer Ceramic Capacitors for General Purpose, 0805, 22uF, X5R, 15%, 20%, 25V; Case/Package: 0805; Depth: 1.25mm; Resistor Type: Ceramic; Voltage Rating: 25V; Lead Free: Lead Free; Voltage Rating (DC): 25V; Case Code (Metric): 2012; Thickness: 0.057inch; REACH SVHC: No SVHC; Material: Ceramic; Tolerance: 20%; Length: 2mm; Capacitance: 22uF; Case Code (Imperial): 0805; Max Operating Temperature: 85°C; Termination: SMD/SMT; Weight: 0.000335oz; Dielectric: X5R; Packaging: Tape and Reel; Voltage: 25V; Package Quantity: 3000; Height: 1.25mm; Mount: Surface Mount; Width: 1.25mm; Min Operating Temperature: -55°C
C111-C113 = CMP-2000-06226-4: Multilayer Ceramic Capacitor 10uF 16V X5R 20% SMD 0603 T/R; Packaging: Tape and Reel; Construction: Flat; Height: 0.8mm; Max Operating Temperature: 85°C; Dielectric: X5R; Case Code (Metric): 1608; Voltage Rating (DC): 16V; Width: 0.031inch; Voltage Rating: 16V; Length: 0.063inch; RoHS Compliant: Yes; Halogen Free: Halogen Free; Case Code (Imperial): 0603; Capacitance: 10uF; Mount: Surface Mount; Thickness: 0.031inch; Tolerance: 20%; Min Operating Temperature: -55°C; Series: M; Termination: SMD/SMT; Case/Package: 0603; Package Quantity: 1
D7 = CMP-004-00040-2: Led, Red/Grn, 180Mcd/230Mcd, 624Nm/525Nm Rohs Compliant: Yes; Source: rgled.SchLib; Component Type: Standard; Design Item ID: CMP-004-00034-2; Pins: 4
F2-F5 = CMP-16042-000006-1: FUSE BOARD MNT 5A 63VAC/VDC 1206; RoHS Compliant: Yes
L3 L6 L9 L12 = CMP-0227-00094-3: NexarPartId: 8917123; Current Rating: 1.2A; Shielding: Shielded; Core Material: Ferrite; Inductance: 100µH; Test Frequency: 100kHz; Tolerance: 30%; Resistance: 255mΩ; Self Resonant Frequency: 6MHz; Composition: Wirewound; Packaging: Cut Tape (CT); REACH SVHC: Unknown; Number of Pins: 2; Max DC Current: 1.2A; Saturation Current: 1.2A; Ambient Temperature Range High: 95°C; Weight: 1.273007g; Height: 3.8mm; Width: 10mm; Min Operating Temperature: -40°C; Max Operating Temperature: 125°C; Termination: SMD/SMT; Height - Seated (Max): 4.0894mm; Length: 10mm; RMS Current (Irms): 1.2A; Ambient Temperature Range Low: -40°C; RoHS: Compliant; Mount: Surface Mount; Depth: 10mm; DC Resistance (DCR): 255mΩ; Inductance Tolerance: 30%; Case/Package: Nonstandard
L4 L7 L10 L13 = CMP-11268-000041-1: NOT COILCRAFT - ACTUAL P# --> ADL32VHC-220M / - Power Injection Chokes for PoC; Manufacturer Part Number: 1210POC-223MRC; Value: 22uH; Core Material: Ferrite; Saturation Current: 720mA; Series Resistance: 0.88Ω; Rms Current: 700mA; Automotive Grade: Grade 1; Self Resonant Frequency: 70MHz; Test Frequency: 100kHz; Tolerance: 20%; Ambient Temperature Range High: +125°C; Manufacturer: coilcraft; Octopart: https://octopart.com/1210poc-223mrc-coilcraft-103207315; Category: Ind; Device Class L2: Inductors; RoHS: TRUE; Device Class L3: Fixed Inductors; Package: 1210POC; Ambient Temperature Range Low: -40°C; ComponentLink2URL: https://drive.google.com/open?id=15FlOq8Y4YbRFohfA_cJ40jgnqs8va2Mh; Lead Free: Yes; Inductance: 22uH; Device Class L1: Passive Components; ComponentLink2Description: Datasheet; Automotive: Yes; Height: 3mm
L5 L8 L11 L14 = CMP-11268-000007-1: Fixed Inductors PFL1609 Low Profile 0.56 uH 20 % 1.4 A; Manufacturer: coilcraft; Rms Current: 1100mA; Self Resonant Frequency: 600MHz; Core Material: Composite; Tolerance: 20%; Value: 0.56uH; Automotive Grade: Grade 1; Saturation Current: 710mA; Test Frequency: 7.9MHz; Shielding: true; Series Resistance: 130mΩ; Lead Free: Yes; Device Class L1: Passive Components; Package: PFL1609; Octopart: https://octopart.com/pfl1609-561mew-coilcraft-20329171; ComponentLink2URL: https://www.coilcraft.com/pdfs/pfl1609.pdf; Manufacturer Part Number: PFL1609-561MEW; Ambient Temperature Range Low: -40°C; Composition: Wirewound; Inductance: 0.56uH; Device Class L2: Inductors; Category: Ind; Device Class L3: Fixed Inductors; Mouser Description: Fixed Inductors PFL1609 Low Profile 0.56 uH 20 % 1.4 A; Automotive: Yes; ComponentLink2Description: Datasheet; Ambient Temperature Range High: +105°C; Height: 0.95mm; RoHS: TRUE
Q2 Q4-Q6 = CMP-2000-04939-1: Dual N & P-Channel 2.5 V Specified PowerTrench(TM) MOSFET, -55 to 150 degC, 6-Pin SOT-23, RoHS, Tape and Reel; Manufacturer: Fairchild; Typical Rise Time: 9@NChannel; Rad Hard: No; Maximum Drain Source Voltage: 20V; Typical Fall Time: 3@NChannel; Typical Turn-On Delay Time: 5@NChannel; Maximum Continuous Drain Current: 2.7@NChannel; Typical Turn-Off Delay Time: 12@NChannel; RDS-on: 80@4.5V@NChannel; Channel Mode: Enhancement; Maximum Gate Source Voltage: ±8V; Package Version: Rev. 5, 05/2015; Operating Temperature: -55to150degC; Packaging: Tape&Reel; Package Reference: SOT23-6; Package URL: https://www.fairchildsemi.com/package-drawings/MA/MA06A.pdf; Package Description: 6-Pin Small Outline Transistor, Body 2.9 x 1.6 mm, Pitch 0.95 mm; Manufacturer URL: https://www.fairchildsemi.com/; Channel Type: N; Datasheet Version: Rev. E, 07/2000; Package: 6SuperSOT; Datasheet URL: https://www.fairchildsemi.com/datasheets/FD/FDC6327C.pdf; Mounting: SurfaceMount; Category: MOSFET
Q3 = CMP-1259-00116-1: Dual P-Channel Trench MOSFET, -50 V, -0.16 A, -55 to 150 degC, 6-Pin SOT363, Tape and Reel; Manufacturer: NXP Semiconductors; VGSth [typ] (V): -1.6; Automotive Qualified: Y; Channel Type: P; IDM [max] (A): -0.64; Packing: Tape & Reel; Mounting Technology: Surface Mount; PackageDescription: 6-Pin Small Outline Transistor Package, Body 2 x 1.25 mm, Pitch 0.65 mm; ComponentLink2URL: http://www.nxp.com/documents/data_sheet/BSS84AKS.pdf; ComponentLink3URL: http://www.nxp.com/documents/outline_drawing/sot363_po.pdf; PartNumber: BSS84AKS,115; PackageReference: SOT363; PackageVersion: 06-03-16, 03/2006; ComponentLink3Description: Package Specification; ComponentLink2Description: Datasheet; ComponentLink1Description: Manufacturer URL; VDS [max] (V): -50; Code_JEITA: SC-88; ID [max] (A): -0.16; DatasheetVersion: Rev. 1; ComponentLink1URL: http://www.nxp.com/
R70 R82 R93 R100 = CMP-009-00002-14: Value: 100k
R71-R81 R83-R92 R94-R99 R101-R105 R107-R116 = CMP-009-00002-14: Resistor
  R72 R77 R84 R92 R94 R98 R101 R105 R113 R115: Value: 100k
  R80 R81: Value: 1k
  R107-R112 R114 R116: Value: 0
R117 = CMP-009-00002-14: Resistor; Value: 100k
U9 = CMP-015-00011-4: Quad Tunneling GMSL2/1 to CSI-2 Deserializer
U12 = CMP-06317-000025-1: QUAD HIGH-SIDE CURRENT SENSOR; Accuracy: 1%; Min Operating Temperature: -40°C; Mount: Surface Mount; Max Operating Temperature: 85°C; Packaging: Cut Tape; RoHS Compliant: No
Y4 = CMP-2000-05733-3: Crystal 25MHz ±20ppm (Tol) ±30ppm (Stability) 18pF FUND 60Ω 4-Pin SMD T/R; Series Resistance: 60R; Length: 3.2mm; Depth: 2.5mm; Packaging: Tape and Reel; Min Operating Temperature: -40°C; Operating Frequency: 25 MHz; Lead Free: Lead Free; Number of Pins: 4; Frequency Tolerance: 20ppm; Radiation Hardening: No; Max Operating Temperature: 85°C; Termination: SMD/SMT; Frequency Stability: 30ppm; Frequency: 25MHz; Series: ABM8G; Mount: Surface Mount; Package Quantity: 1000; Height: 0.039inch; Width: 0.098inch; Case/Package: CSMD; ESR (Equivalent Series Resistance): 60R; Load Capacitance: 18pF; Tolerance: 20ppm